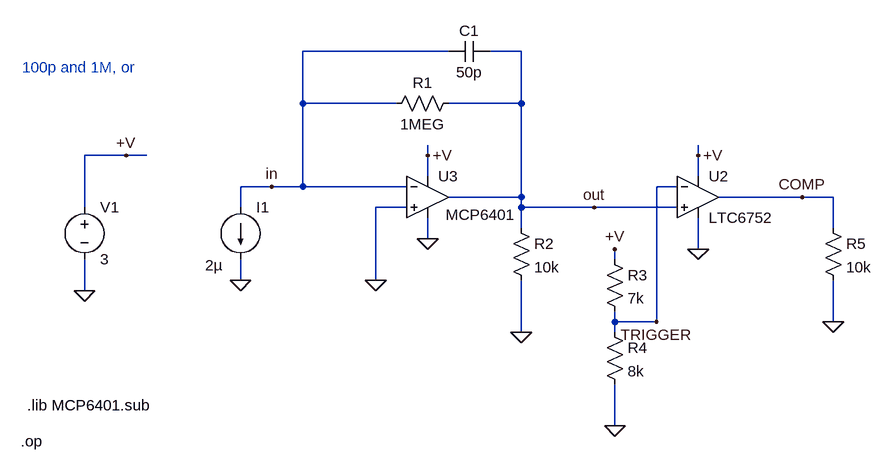
[diagram p0: schematic DasBlinkinput.asc]
DasBlinkinput.asc, the LTspice schematic file:
Version 4
SHEET 1 1060 680
WIRE 400 -16 176 -16
WIRE 512 -16 464 -16
WIRE 176 64 176 -16
WIRE 320 64 176 64
WIRE 512 64 512 -16
WIRE 512 64 400 64
WIRE -96 144 -160 144
WIRE -64 144 -96 144
WIRE 368 144 368 128
WIRE 784 144 784 128
WIRE 368 176 368 144
WIRE 784 176 784 144
WIRE 128 192 80 192
WIRE 176 192 176 64
WIRE 176 192 128 192
WIRE 336 192 176 192
WIRE 752 192 720 192
WIRE 512 208 512 64
WIRE 512 208 400 208
WIRE 944 208 816 208
WIRE 992 208 944 208
WIRE -160 224 -160 144
WIRE 80 224 80 192
WIRE 336 224 288 224
WIRE 512 224 512 208
WIRE 624 224 512 224
WIRE 752 224 624 224
WIRE 512 256 512 224
WIRE 992 256 992 208
WIRE 368 272 368 240
WIRE 784 288 784 240
WIRE 656 304 656 288
WIRE 80 336 80 304
WIRE 288 336 288 224
WIRE -160 352 -160 304
WIRE 656 400 656 384
WIRE 720 400 720 192
WIRE 720 400 656 400
WIRE 992 400 992 336
WIRE 512 416 512 336
WIRE 656 416 656 400
WIRE 656 560 656 496
FLAG -160 352 0
FLAG -96 144 +V
FLAG 368 144 +V
FLAG 288 336 0
FLAG 80 336 0
FLAG 512 416 0
FLAG 368 272 0
FLAG 784 288 0
FLAG 784 144 +V
FLAG 656 288 +V
FLAG 656 560 0
FLAG 992 400 0
FLAG 128 192 in
FLAG 624 224 out
FLAG 944 208 COMP
FLAG 720 400 TRIGGER
SYMBOL voltage -160 208 R0
SYMATTR InstName V1
SYMATTR Value 3
SYMBOL res 416 48 R90
WINDOW 0 0 56 VBottom 2
WINDOW 3 32 56 VTop 2
SYMATTR InstName R1
SYMATTR Value 1MEG
SYMBOL current 80 224 R0
WINDOW 3 -54 89 Left 2
WINDOW 123 24 28 Left 2
WINDOW 39 0 0 Left 2
SYMATTR Value 2µ
SYMATTR InstName I1
SYMBOL res 496 240 R0
SYMATTR InstName R2
SYMATTR Value 10k
SYMBOL res 640 288 R0
SYMATTR InstName R3
SYMATTR Value 7k
SYMBOL res 640 400 R0
SYMATTR InstName R4
SYMATTR Value 8k
SYMBOL res 976 240 R0
SYMATTR InstName R5
SYMATTR Value 10k
SYMBOL Comparators\\LTC6752 784 144 R0
SYMATTR InstName U2
SYMBOL cap 464 -32 R90
WINDOW 0 0 32 VBottom 2
WINDOW 3 32 32 VTop 2
SYMATTR InstName C1
SYMATTR Value 50p
SYMBOL Opamps\\UniversalOpamp2 368 208 R0
WINDOW 3 28 27 Left 2
SYMATTR InstName U3
SYMATTR SpiceModel ""
SYMATTR Value2 ""
SYMATTR SpiceLine ""
SYMATTR SpiceLine2 ""
SYMATTR Value MCP6401
TEXT -256 8 Left 2 ;100p and 1M, or
TEXT -248 528 Left 2 !.lib MCP6401.sub
TEXT -258 584 Left 2 !.op

The netlist it stands for:
* DasBlinkinput.asc
V1 +V 0 3
R1 out in 1MEG
I1 in 0 2µ
R2 out 0 10k
R3 +V TRIGGER 7k
R4 TRIGGER 0 8k
R5 COMP 0 10k
XU2 out TRIGGER +V 0 COMP LTC6752  ; pins In+ In- V+ V- OUT
C1 out in 50p
XU3 0 in +V 0 out MCP6401  ; pins IN+ IN- V+ V- OUT
* 100p and 1M, or
.lib MCP6401.sub
.op
.lib LTC7.lib
.lib UniversalOpamps2.sub
.backanno
.end

* Results of the author's LTspice run, read from the files saved beside the schematic
* Operating Point:
*   V(+v) = 3 V
*   V(out) = 1.997 V
*   V(in) = -3.419 mV
*   V(trigger) = 1.607 V
*   V(comp) = 2.997 V
*   I(C1) = 0 A
*   I(I1) = 2 µA
*   I(R5) = 299.7 µA
*   I(R4) = 200.8 µA
*   I(R3) = 199 µA
*   I(R2) = 199.7 µA
*   I(R1) = 2 µA
*   I(V1) = -5.443 mA
*   Ix(u2:1) = 1.031 µA
*   Ix(u2:2) = -1.8 µA
*   Ix(u2:3) = 4.997 mA
*   Ix(u2:4) = -4.697 mA
*   Ix(u2:5) = -299.7 µA
*   Ix(u3:1) = 2.202 pA
*   Ix(u3:2) = -32.38 fA
*   Ix(u3:3) = 246.5 µA
*   Ix(u3:4) = -43.78 µA
*   Ix(u3:5) = -202.7 µA
* From the log:
*   Semiconductor Device Operating Points:
*                           --- Diodes ---
*   Name:    d:u3:99     d:u3:98     d:u3:21     d:u3:20     d:u2:18
*   Model:   u3:desd     u3:desd     u3:dn1      u3:dn1     u2:dbiasc
*   Id:     -1.00e-12   -2.00e-12    4.23e-04    4.23e-04   -8.00e-07
*   Vd:     -1.00e+00   -2.00e+00    5.14e-01    5.14e-01   -3.90e-01
*   Req:     1.00e+12    1.00e+12    6.11e+01    6.11e+01    1.75e-05
*   CAP:     0.00e+00    0.00e+00    0.00e+00    0.00e+00    0.00e+00
*   Name:    d:u2:19     d:u2:9      d:u2:16     d:u2:17     d:u2:15
*   Model:   u2:desd     u2:desd     u2:desd     u2:desd     u2:desd
*   Id:     -2.00e-09   -1.00e-09   -1.61e-09   -1.39e-09   -3.00e-09
*   Vd:     -2.00e+00   -1.00e+00   -1.61e+00   -1.39e+00   -3.00e+00
*   Req:     1.00e-09    1.00e-09    1.00e-09    1.00e-09    1.00e-09
*   CAP:     0.00e+00    0.00e+00    0.00e+00    0.00e+00    0.00e+00
*   Name:    d:u2:14     d:u2:11     d:u2:8      d:u2:4      d:u2:7
*   Model:   u2:desd    u2:dburn    u2:dbiasf   u2:dbiasf   u2:dbiasr
*   Id:     -3.38e-12    3.56e-03    3.31e-07    3.14e-07    1.20e-09
*   Vd:     -3.38e-03    3.00e+00    2.00e+00    1.61e+00    1.00e+00
*   Req:     1.00e-09    1.00e-02    3.33e-06    3.33e-06    1.00e-05
*   CAP:     0.00e+00    0.00e+00    0.00e+00    0.00e+00    0.00e+00
*   Name:    d:u2:2      d:u2:1      d:u2:5
*   Model:  u2:dbiasr   u2:dvgain    u2:dlat
*   Id:      1.17e-06    3.55e-06   -1.00e-04
*   Vd:      1.39e+00    3.73e-01   -1.00e+00
*   Req:     1.00e-05    1.00e-05    1.00e-04
*   CAP:     0.00e+00    0.00e+00    0.00e+00
*                           --- VDMOSFET Transistors ---
*   Name:        m:u2:4      m:u2:3
*   Model:        u2:pi       u2:ni
*   Id:         -3.00e-04    3.01e-12
*   Vgs:        -2.55e+00   -2.15e-01
*   Vds:        -3.38e-03    3.00e+00
*   Vth:        -6.00e-01    6.00e-01
*   Gm:          1.54e-04    0.00e+00
*   Gds:         8.86e-02    0.00e+00
*   Cgs:         0.00e+00    0.00e+00
*   Cgd:         0.00e+00    0.00e+00
*   Cbody:       0.00e+00    0.00e+00
*                           --- MOSFET Transistors ---
*   Name:        m:u3:14     m:u3:12
*   Model:       u3:nmi      u3:nmi
*   Id:          1.00e-05    1.00e-05
*   Vgs:         2.00e-01    2.00e-01
*   Vds:         3.50e+00    3.50e+00
*   Vbs:         0.00e+00    0.00e+00
*   Vth:         0.00e+00    0.00e+00
*   Vdsat:       2.00e-01    2.00e-01
*   Gm:          1.00e-04    1.00e-04
*   Gds:         0.00e+00    0.00e+00
*   Gmb:         0.00e+00    0.00e+00
*   Cbd:         0.00e+00    0.00e+00
*   Cbs:         0.00e+00    0.00e+00
*   Cgsov:       0.00e+00    0.00e+00
*   Cgdov:       0.00e+00    0.00e+00
*   Cgbov:       0.00e+00    0.00e+00
*   Cgs:         0.00e+00    0.00e+00
*   Cgd:         0.00e+00    0.00e+00
*   Cgb:         0.00e+00    0.00e+00